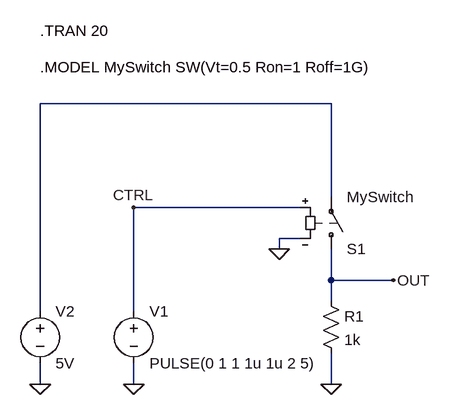
[diagram p0: schematic SwTst.asc]
SwTst.asc, the LTspice schematic file:
Version 4
SHEET 1 880 680
WIRE 192 160 192 16
WIRE 192 16 -256 16
WIRE 192 240 192 288
WIRE 192 400 192 448
WIRE 144 224 112 224
WIRE 112 224 112 240
WIRE 144 176 -112 176
WIRE -112 336 -112 176
WIRE -112 416 -112 448
WIRE -256 336 -256 16
WIRE -256 416 -256 448
WIRE 192 288 288 288
WIRE 192 288 192 320
FLAG 112 240 0
FLAG -112 448 0
FLAG 192 448 0
FLAG -256 448 0
FLAG 288 288 OUT
FLAG -112 176 CTRL
SYMBOL sw 192 256 M180
SYMATTR InstName S1
SYMATTR Value MySwitch
SYMBOL res 176 304 R0
SYMATTR InstName R1
SYMATTR Value 1k
SYMBOL voltage -112 320 R0
WINDOW 123 0 0 Left 0
WINDOW 39 0 0 Left 0
SYMATTR InstName V1
SYMATTR Value PULSE(0 1 1 1u 1u 2 5)
SYMBOL voltage -256 320 R0
SYMATTR InstName V2
SYMATTR Value 5V
TEXT -256 -40 Left 0 !.MODEL MySwitch SW(Vt=0.5 Ron=1 Roff=1G)
TEXT -256 -96 Left 0 !.TRAN 20

The netlist it stands for:
* SwTst.asc
S1 OUT N001 CTRL 0 MySwitch
R1 OUT 0 1k
V1 CTRL 0 PULSE(0 1 1 1u 1u 2 5)
V2 N001 0 5V
.MODEL MySwitch SW(Vt=0.5 Ron=1 Roff=1G)
.TRAN 20
.backanno
.end